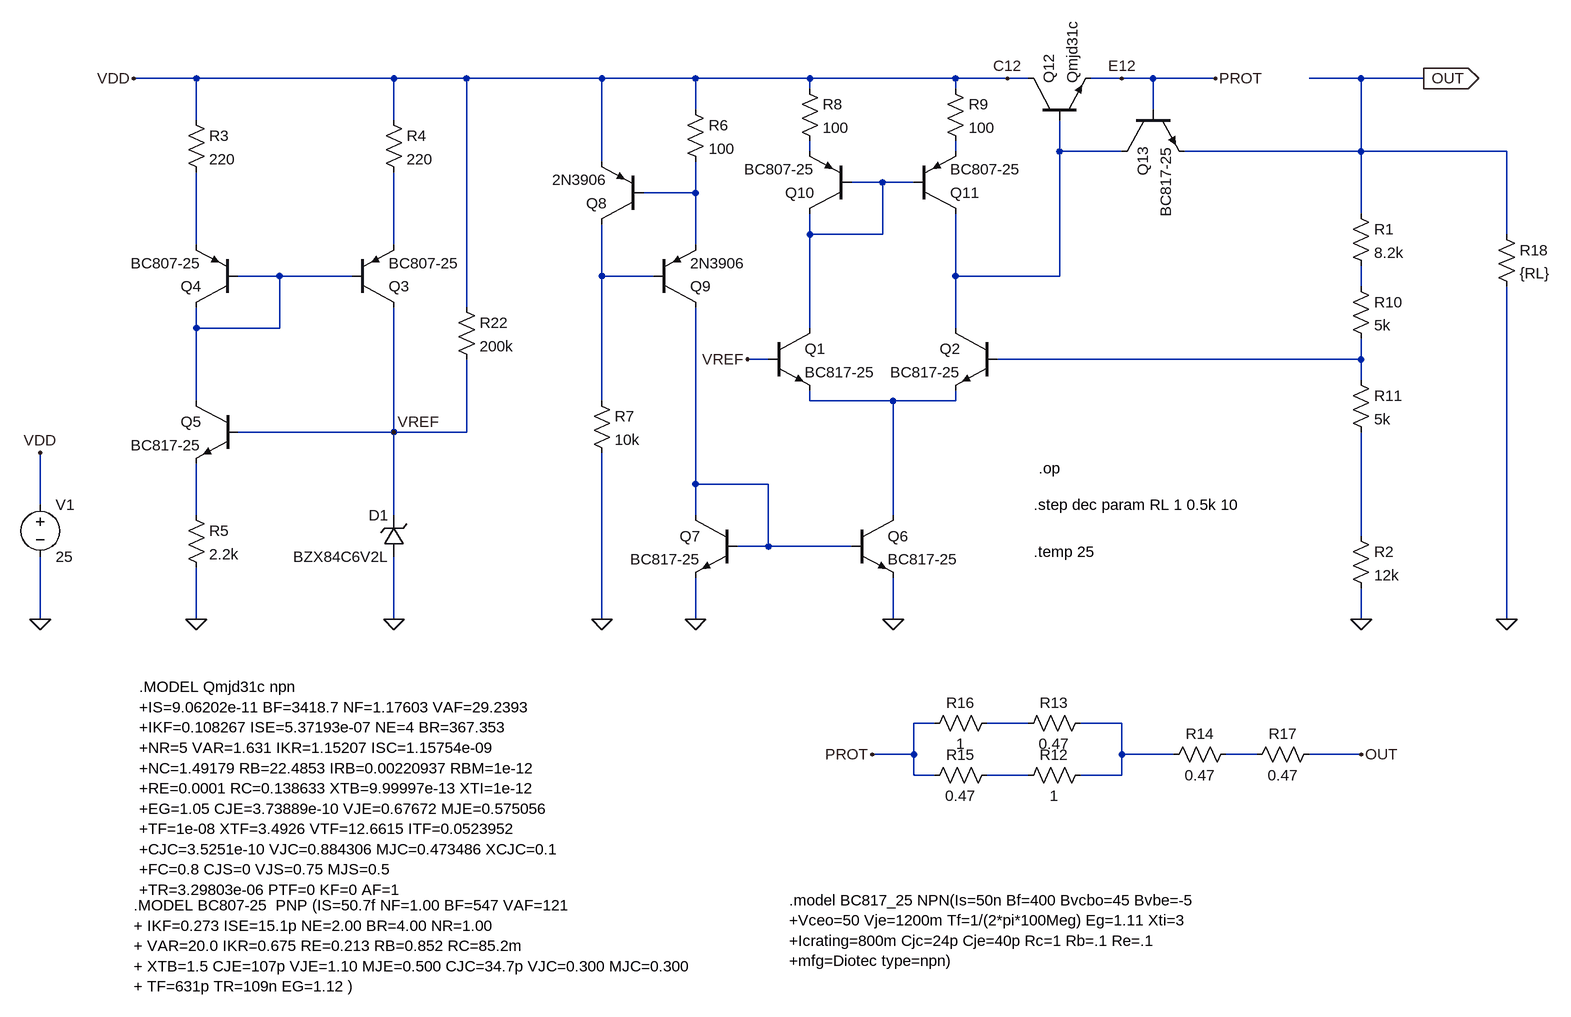
[diagram p0: schematic LOAD_REGULATION.asc]
LOAD_REGULATION.asc, the LTspice schematic file:
Version 4
SHEET 1 1556 936
WIRE -688 -464 -784 -464
WIRE -384 -464 -688 -464
WIRE -272 -464 -384 -464
WIRE -64 -464 -272 -464
WIRE 80 -464 -64 -464
WIRE 256 -464 80 -464
WIRE 480 -464 256 -464
WIRE 560 -464 480 -464
WIRE 592 -464 560 -464
WIRE 736 -464 688 -464
WIRE 784 -464 736 -464
WIRE 880 -464 784 -464
WIRE 1104 -464 1024 -464
WIRE 1200 -464 1104 -464
WIRE 256 -448 256 -464
WIRE 480 -448 480 -464
WIRE 80 -416 80 -464
WIRE 784 -416 784 -464
WIRE -688 -400 -688 -464
WIRE -384 -400 -384 -464
WIRE 256 -352 256 -368
WIRE 480 -352 480 -368
WIRE 640 -352 640 -400
WIRE 736 -352 640 -352
WIRE 1104 -352 1104 -464
WIRE 1104 -352 832 -352
WIRE 1328 -352 1104 -352
WIRE -64 -336 -64 -464
WIRE 368 -304 320 -304
WIRE 416 -304 368 -304
WIRE 80 -288 80 -336
WIRE 80 -288 0 -288
WIRE 1104 -256 1104 -352
WIRE 256 -224 256 -256
WIRE 368 -224 368 -304
WIRE 368 -224 256 -224
WIRE 1328 -224 1328 -352
WIRE -688 -208 -688 -320
WIRE -384 -208 -384 -320
WIRE 80 -208 80 -288
WIRE -560 -160 -624 -160
WIRE -448 -160 -560 -160
WIRE -64 -160 -64 -240
WIRE 16 -160 -64 -160
WIRE 480 -160 480 -256
WIRE 640 -160 640 -352
WIRE 640 -160 480 -160
WIRE 1104 -144 1104 -176
WIRE -272 -112 -272 -464
WIRE -688 -80 -688 -112
WIRE -560 -80 -560 -160
WIRE -560 -80 -688 -80
WIRE 256 -80 256 -224
WIRE 480 -80 480 -160
WIRE 192 -32 160 -32
WIRE 1104 -32 1104 -64
WIRE 1104 -32 544 -32
WIRE 1104 0 1104 -32
WIRE -688 32 -688 -80
WIRE -64 32 -64 -160
WIRE 256 32 256 16
WIRE 384 32 256 32
WIRE 480 32 480 16
WIRE 480 32 384 32
WIRE -384 80 -384 -112
WIRE -384 80 -624 80
WIRE -272 80 -272 -32
WIRE -272 80 -384 80
WIRE 80 160 80 -112
WIRE 192 160 80 160
WIRE -928 192 -928 112
WIRE -688 208 -688 128
WIRE -384 208 -384 80
WIRE 80 208 80 160
WIRE 384 208 384 32
WIRE 1104 240 1104 80
WIRE 192 256 192 160
WIRE 192 256 144 256
WIRE 320 256 192 256
WIRE -928 368 -928 272
WIRE -688 368 -688 288
WIRE -384 368 -384 272
WIRE -64 368 -64 112
WIRE 80 368 80 304
WIRE 384 368 384 304
WIRE 1104 368 1104 320
WIRE 1328 368 1328 -144
WIRE 448 528 416 528
WIRE 592 528 528 528
WIRE 736 528 672 528
WIRE 416 576 416 528
WIRE 416 576 352 576
WIRE 736 576 736 528
WIRE 816 576 736 576
WIRE 944 576 896 576
WIRE 1104 576 1024 576
WIRE 416 608 416 576
WIRE 448 608 416 608
WIRE 592 608 528 608
WIRE 736 608 736 576
WIRE 736 608 672 608
FLAG 1104 368 0
FLAG -688 368 0
FLAG 384 368 0
FLAG 80 368 0
FLAG -64 368 0
FLAG 160 -32 VREF
FLAG 1200 -464 OUT
IOPIN 1200 -464 Out
FLAG 560 -464 C12
FLAG 736 -464 E12
FLAG -928 368 0
FLAG 880 -464 PROT
FLAG 352 576 PROT
FLAG 1104 576 OUT
FLAG -928 112 VDD
FLAG -784 -464 VDD
FLAG -384 368 0
FLAG -384 80 VREF
FLAG 1328 368 0
SYMBOL npn 192 -80 R0
SYMATTR InstName Q1
SYMATTR Value BC817-25
SYMBOL npn 544 -80 M0
SYMATTR InstName Q2
SYMATTR Value BC817-25
SYMBOL res 1088 -272 R0
SYMATTR InstName R1
SYMATTR Value 8.2k
SYMBOL res 1088 224 R0
SYMATTR InstName R2
SYMATTR Value 12k
SYMBOL pnp -448 -112 M180
SYMATTR InstName Q3
SYMATTR Value BC807-25
SYMBOL pnp -624 -112 R180
SYMATTR InstName Q4
SYMATTR Value BC807-25
SYMBOL npn -624 32 M0
SYMATTR InstName Q5
SYMATTR Value BC817-25
SYMBOL res -704 -416 R0
SYMATTR InstName R3
SYMATTR Value 220
SYMBOL res -400 -416 R0
SYMATTR InstName R4
SYMATTR Value 220
SYMBOL res -704 192 R0
SYMATTR InstName R5
SYMATTR Value 2.2k
SYMBOL npn 320 208 R0
SYMATTR InstName Q6
SYMATTR Value BC817-25
SYMBOL npn 144 208 M0
SYMATTR InstName Q7
SYMATTR Value BC817-25
SYMBOL pnp 0 -240 R180
SYMATTR InstName Q8
SYMATTR Value 2N3906
SYMBOL pnp 16 -112 M180
SYMATTR InstName Q9
SYMATTR Value 2N3906
SYMBOL res 64 -432 R0
SYMATTR InstName R6
SYMATTR Value 100
SYMBOL res -80 16 R0
SYMATTR InstName R7
SYMATTR Value 10k
SYMBOL pnp 320 -256 R180
SYMATTR InstName Q10
SYMATTR Value BC807-25
SYMBOL pnp 416 -256 M180
SYMATTR InstName Q11
SYMATTR Value BC807-25
SYMBOL npn 592 -400 R270
SYMATTR InstName Q12
SYMATTR Value Qmjd31c
SYMBOL res 240 -464 R0
SYMATTR InstName R8
SYMATTR Value 100
SYMBOL res 464 -464 R0
SYMATTR InstName R9
SYMATTR Value 100
SYMBOL npn 736 -416 M90
SYMATTR InstName Q13
SYMATTR Value BC817-25
SYMBOL res 1088 -160 R0
SYMATTR InstName R10
SYMATTR Value 5k
SYMBOL res 1088 -16 R0
SYMATTR InstName R11
SYMATTR Value 5k
SYMBOL res 688 592 R90
WINDOW 0 0 56 VBottom 2
WINDOW 3 32 56 VTop 2
SYMATTR InstName R12
SYMATTR Value 1
SYMBOL res 688 512 R90
WINDOW 0 0 56 VBottom 2
WINDOW 3 32 56 VTop 2
SYMATTR InstName R13
SYMATTR Value 0.47
SYMBOL res 912 560 R90
WINDOW 0 0 56 VBottom 2
WINDOW 3 32 56 VTop 2
SYMATTR InstName R14
SYMATTR Value 0.47
SYMBOL res 544 592 R90
WINDOW 0 0 56 VBottom 2
WINDOW 3 32 56 VTop 2
SYMATTR InstName R15
SYMATTR Value 0.47
SYMBOL res 544 512 R90
WINDOW 0 0 56 VBottom 2
WINDOW 3 32 56 VTop 2
SYMATTR InstName R16
SYMATTR Value 1
SYMBOL res 1040 560 R90
WINDOW 0 0 56 VBottom 2
WINDOW 3 32 56 VTop 2
SYMATTR InstName R17
SYMATTR Value 0.47
SYMBOL zener -368 272 R180
WINDOW 0 24 64 Left 2
WINDOW 3 24 0 Left 2
SYMATTR InstName D1
SYMATTR Value BZX84C6V2L
SYMBOL voltage -928 176 R0
WINDOW 123 0 0 Left 0
WINDOW 39 0 0 Left 0
SYMATTR InstName V1
SYMATTR Value 25
SYMBOL res 1312 -240 R0
SYMATTR InstName R18
SYMATTR Value {RL}
SYMBOL res -288 -128 R0
SYMATTR InstName R22
SYMATTR Value 200k
TEXT 600 192 Left 2 !.step dec param RL 1 0.5k 10
TEXT 224 800 Left 2 !.model BC817_25 NPN(Is=50n Bf=400 Bvcbo=45 Bvbe=-5\n+Vceo=50 Vje=1200m Tf=1/(2*pi*100Meg) Eg=1.11 Xti=3\n+Icrating=800m Cjc=24p Cje=40p Rc=1 Rb=.1 Re=.1\n+mfg=Diotec type=npn)
TEXT -776 472 Left 2 !.MODEL Qmjd31c npn\n+IS=9.06202e-11 BF=3418.7 NF=1.17603 VAF=29.2393\n+IKF=0.108267 ISE=5.37193e-07 NE=4 BR=367.353\n+NR=5 VAR=1.631 IKR=1.15207 ISC=1.15754e-09\n+NC=1.49179 RB=22.4853 IRB=0.00220937 RBM=1e-12\n+RE=0.0001 RC=0.138633 XTB=9.99997e-13 XTI=1e-12\n+EG=1.05 CJE=3.73889e-10 VJE=0.67672 MJE=0.575056\n+TF=1e-08 XTF=3.4926 VTF=12.6615 ITF=0.0523952\n+CJC=3.5251e-10 VJC=0.884306 MJC=0.473486 XCJC=0.1\n+FC=0.8 CJS=0 VJS=0.75 MJS=0.5\n+TR=3.29803e-06 PTF=0 KF=0 AF=1
TEXT -784 808 Left 2 !.MODEL BC807-25  PNP (IS=50.7f NF=1.00 BF=547 VAF=121\n+ IKF=0.273 ISE=15.1p NE=2.00 BR=4.00 NR=1.00\n+ VAR=20.0 IKR=0.675 RE=0.213 RB=0.852 RC=85.2m\n+ XTB=1.5 CJE=107p VJE=1.10 MJE=0.500 CJC=34.7p VJC=0.300 MJC=0.300 \n+ TF=631p TR=109n EG=1.12 )
TEXT 600 264 Left 2 !.temp 25
TEXT 608 136 Left 2 !.op

The netlist it stands for:
* LOAD_REGULATION.asc
Q1 N004 VREF N012 0 BC817-25
Q2 N003 N011 N012 0 BC817-25
R1 OUT N010 8.2k
R2 N015 0 12k
Q3 VREF N008 N007 0 BC807-25
Q4 N008 N008 N006 0 BC807-25
Q5 N008 VREF N014 0 BC817-25
R3 VDD N006 220
R4 VDD N007 220
R5 N014 0 2.2k
Q6 N012 N013 0 0 BC817-25
Q7 N013 N013 0 0 BC817-25
Q8 N009 N005 VDD 0 2N3906
Q9 N013 N009 N005 0 2N3906
R6 VDD N005 100
R7 N009 0 10k
Q10 N004 N004 N001 0 BC807-25
Q11 N003 N004 N002 0 BC807-25
Q12 VDD N003 PROT 0 Qmjd31c
R8 VDD N001 100
R9 VDD N002 100
Q13 N003 PROT OUT 0 BC817-25
R10 N010 N011 5k
R11 N011 N015 5k
R12 N017 N019 1
R13 N017 N016 0.47
R14 N018 N017 0.47
R15 N019 PROT 0.47
R16 N016 PROT 1
R17 OUT N018 0.47
D1 0 VREF BZX84C6V2L
V1 VDD 0 25
R18 OUT 0 {RL}
R22 VDD VREF 200k
.model D D
.lib standard.dio
.model NPN NPN
.model PNP PNP
.lib standard.bjt
.step dec param RL 1 0.5k 10
.model BC817_25 NPN(Is=50n Bf=400 Bvcbo=45 Bvbe=-5
+Vceo=50 Vje=1200m Tf=1/(2*pi*100Meg) Eg=1.11 Xti=3
+Icrating=800m Cjc=24p Cje=40p Rc=1 Rb=.1 Re=.1
+mfg=Diotec type=npn)
.MODEL Qmjd31c npn
+IS=9.06202e-11 BF=3418.7 NF=1.17603 VAF=29.2393
+IKF=0.108267 ISE=5.37193e-07 NE=4 BR=367.353
+NR=5 VAR=1.631 IKR=1.15207 ISC=1.15754e-09
+NC=1.49179 RB=22.4853 IRB=0.00220937 RBM=1e-12
+RE=0.0001 RC=0.138633 XTB=9.99997e-13 XTI=1e-12
+EG=1.05 CJE=3.73889e-10 VJE=0.67672 MJE=0.575056
+TF=1e-08 XTF=3.4926 VTF=12.6615 ITF=0.0523952
+CJC=3.5251e-10 VJC=0.884306 MJC=0.473486 XCJC=0.1
+FC=0.8 CJS=0 VJS=0.75 MJS=0.5
+TR=3.29803e-06 PTF=0 KF=0 AF=1
.MODEL BC807-25  PNP (IS=50.7f NF=1.00 BF=547 VAF=121
+ IKF=0.273 ISE=15.1p NE=2.00 BR=4.00 NR=1.00
+ VAR=20.0 IKR=0.675 RE=0.213 RB=0.852 RC=85.2m
+ XTB=1.5 CJE=107p VJE=1.10 MJE=0.500 CJC=34.7p VJC=0.300 MJC=0.300
+ TF=631p TR=109n EG=1.12 )
.temp 25
.op
.backanno
.end